# Altium schematic sheet GSM.SchDoc: IoT_Gateway
size A4; Date: *******; ApprovedBy: *******; CheckedBy: Parth Patel; Author: *******; CompanyName: *******; DrawnBy: Parth Patel; Engineer: *******; Organization: *******; Address1: *******; Address2: *******; Address3: *******; Address4: *******; DocumentNumber: 1; Revision: *******; SheetNumber: 2; SheetTotal: 9; Version: V1.0.0; CurrentTime: *******; CurrentDate: *******; Time: *******; DocumentFullPathAndName: *******; DocumentName: *******; ModifiedDate: *******; ImagePath: *******; ProjectName: *******; Application_BuildNumber: *******
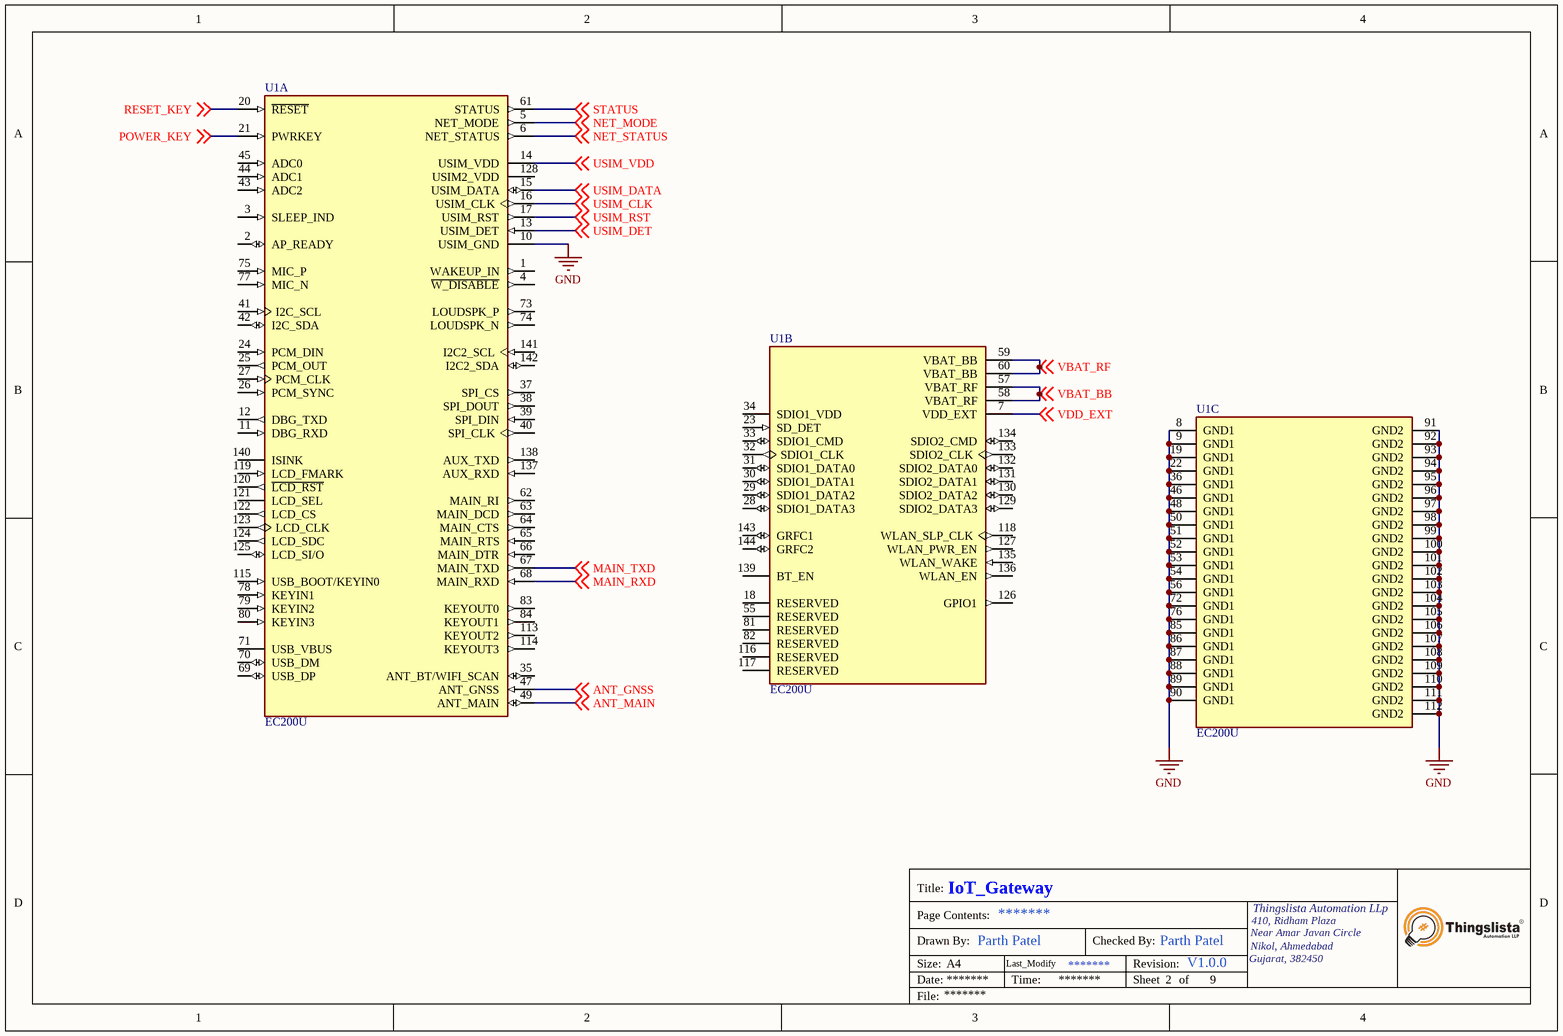
[diagram p0: GSM.SchDoc]

## Parts
U1  EC200U  [XCVR_EC200U]  (parts A,B,C of 3)

## Nets
GND: U1.8(GND1) U1.9(GND1) U1.10(USIM_GND) U1.19(GND1) U1.22(GND1) U1.36(GND1) U1.46(GND1) U1.48(GND1) U1.50(GND1) U1.51(GND1) U1.52(GND1) U1.53(GND1) U1.54(GND1) U1.56(GND1) U1.72(GND1) U1.76(GND1) U1.85(GND1) U1.86(GND1) U1.87(GND1) U1.88(GND1) U1.89(GND1) U1.90(GND1) U1.91(GND2) U1.92(GND2) U1.93(GND2) U1.94(GND2) U1.95(GND2) U1.96(GND2) U1.97(GND2) U1.98(GND2) U1.99(GND2) U1.100(GND2) U1.101(GND2) U1.102(GND2) U1.103(GND2) U1.104(GND2) U1.105(GND2) U1.106(GND2) U1.107(GND2) U1.108(GND2) U1.109(GND2) U1.110(GND2) U1.111(GND2) U1.112(GND2)
ANT_GNSS: U1.47(ANT_GNSS) ; off-sheet ANT_GNSS
ANT_MAIN: U1.49(ANT_MAIN) ; off-sheet ANT_MAIN
MAIN_RXD: U1.68(MAIN_RXD) ; off-sheet MAIN_RXD
MAIN_TXD: U1.67(MAIN_TXD) ; off-sheet MAIN_TXD
NET_MODE: U1.5(NET_MODE) ; off-sheet NET_MODE
NET_STATUS: U1.6(NET_STATUS) ; off-sheet NET_STATUS
POWER_KEY: U1.21(PWRKEY) ; off-sheet POWER_KEY
RESET_KEY: U1.20(~{RESET}) ; off-sheet RESET_KEY
STATUS: U1.61(STATUS) ; off-sheet STATUS
USIM_CLK: U1.16(USIM_CLK) ; off-sheet USIM_CLK
USIM_DATA: U1.15(USIM_DATA) ; off-sheet USIM_DATA
USIM_DET: U1.13(USIM_DET) ; off-sheet USIM_DET
USIM_RST: U1.17(USIM_RST) ; off-sheet USIM_RST
USIM_VDD: U1.14(USIM_VDD) ; off-sheet USIM_VDD
VBAT_BB: U1.57(VBAT_RF) U1.58(VBAT_RF) ; off-sheet VBAT_BB
VBAT_RF: U1.59(VBAT_BB) U1.60(VBAT_BB) ; off-sheet VBAT_RF
VDD_EXT: U1.7(VDD_EXT) ; off-sheet VDD_EXT

Not connected (* = marked no-connect by the designer): U1 1(WAKEUP_IN) 2(AP_READY) 3(SLEEP_IND) 4(~{W_DISABLE}) 11(DBG_RXD) 12(DBG_TXD) 18(RESERVED) 23(SD_DET) 24(PCM_DIN) 25(PCM_OUT) 26(PCM_SYNC) 27(PCM_CLK) 28(SDIO1_DATA3) 29(SDIO1_DATA2) 30(SDIO1_DATA1) 31(SDIO1_DATA0) 32(SDIO1_CLK) 33(SDIO1_CMD) 34(SDIO1_VDD) 35(ANT_BT/WIFI_SCAN) 37(SPI_CS) 38(SPI_DOUT) 39(SPI_DIN) 40(SPI_CLK) 41(I2C_SCL) 42(I2C_SDA) 43(ADC2) 44(ADC1) 45(ADC0) 55(RESERVED) 62(MAIN_RI) 63(MAIN_DCD) 64(MAIN_CTS) 65(MAIN_RTS) 66(MAIN_DTR) 69(USB_DP) 70(USB_DM) 71(USB_VBUS) 73(LOUDSPK_P) 74(LOUDSPK_N) 75(MIC_P) 77(MIC_N) 78(KEYIN1) 79(KEYIN2) 80(KEYIN3) 81(RESERVED) 82(RESERVED) 83(KEYOUT0) 84(KEYOUT1) 113(KEYOUT2) 114(KEYOUT3) 115(USB_BOOT/KEYIN0) 116(RESERVED) 117(RESERVED) 118(WLAN_SLP_CLK) 119(LCD_FMARK) 120(~{LCD_RST}) 121(LCD_SEL) 122(LCD_CS) 123(LCD_CLK) 124(LCD_SDC) 125(LCD_SI/O) 126(GPIO1) 127(WLAN_PWR_EN) 128(USIM2_VDD) 129(SDIO2_DATA3) 130(SDIO2_DATA2) 131(SDIO2_DATA1) 132(SDIO2_DATA0) 133(SDIO2_CLK) 134(SDIO2_CMD) 135(WLAN_WAKE) 136(WLAN_EN) 137(AUX_RXD) 138(AUX_TXD) 139(BT_EN) 140(ISINK) 141(I2C2_SCL) 142(I2C2_SDA) 143(GRFC1) 144(GRFC2)

## Notes on the sheet
- Title:
- Page Contents:
- 410, Ridham Plaza
- Thingslista Automation LLp
- Size:
- Date:
- File:
- Drawn By:
- A4
- Last_Modify
- Time:
- Checked By:
- Revision:
- Sheet
- of
- Gujarat, 382450
- Near Amar Javan Circle
- Nikol, Ahmedabad

## Library data of the parts
U1 = EC200U: Package: None; Price: None; Value: *; MP: EC200U; Availability: Unavailable